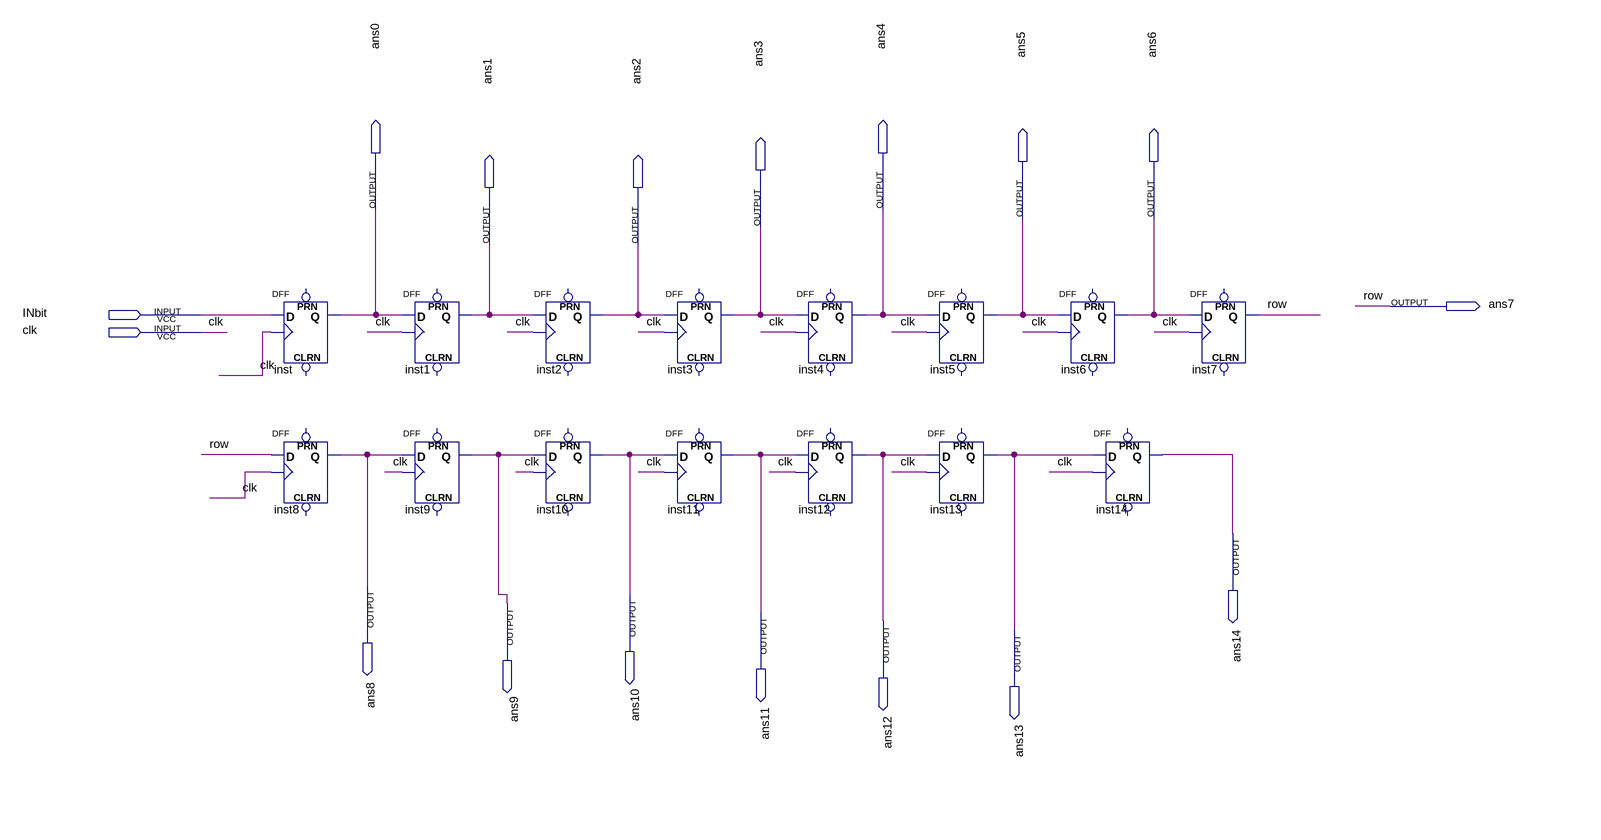
[diagram p0: schematic sheet]
// Quartus schematic ans.bdf as structural Verilog: 15 symbols, 17 pins
module ans (
  input  INbit,
  input  clk,
  output ans0,
  output ans4,
  output ans5,
  output ans6,
  output ans3,
  output ans1,
  output ans2,
  output ans7,
  output ans14,
  output ans8,
  output ans10,
  output ans9,
  output ans11,
  output ans12,
  output ans13
);

  DFF inst (.CLK(clk), .D(INbit), .Q(ans0));  // open: CLRN, PRN
  DFF inst8 (.CLK(clk), .D(ans7), .Q(ans8));  // open: CLRN, PRN
  DFF inst1 (.CLK(clk), .D(ans0), .Q(ans1));  // open: CLRN, PRN
  DFF inst9 (.CLK(clk), .D(ans8), .Q(ans9));  // open: CLRN, PRN
  DFF inst2 (.CLK(clk), .D(ans1), .Q(ans2));  // open: CLRN, PRN
  DFF inst10 (.CLK(clk), .D(ans9), .Q(ans10));  // open: CLRN, PRN
  DFF inst3 (.CLK(clk), .D(ans2), .Q(ans3));  // open: CLRN, PRN
  DFF inst11 (.CLK(clk), .D(ans10), .Q(ans11));  // open: CLRN, PRN
  DFF inst4 (.CLK(clk), .D(ans3), .Q(ans4));  // open: CLRN, PRN
  DFF inst12 (.CLK(clk), .D(ans11), .Q(ans12));  // open: CLRN, PRN
  DFF inst5 (.CLK(clk), .D(ans4), .Q(ans5));  // open: CLRN, PRN
  DFF inst13 (.CLK(clk), .D(ans12), .Q(ans13));  // open: CLRN, PRN
  DFF inst6 (.CLK(clk), .D(ans5), .Q(ans6));  // open: CLRN, PRN
  DFF inst14 (.CLK(clk), .D(ans13), .Q(ans14));  // open: CLRN, PRN
  DFF inst7 (.CLK(clk), .D(ans6), .Q(ans7));  // open: CLRN, PRN

  // Other names for the same wires on the sheet: row = ans7
endmodule
